# EasyEDA Pro project compute-module-v101.eprj, board digital-input-module
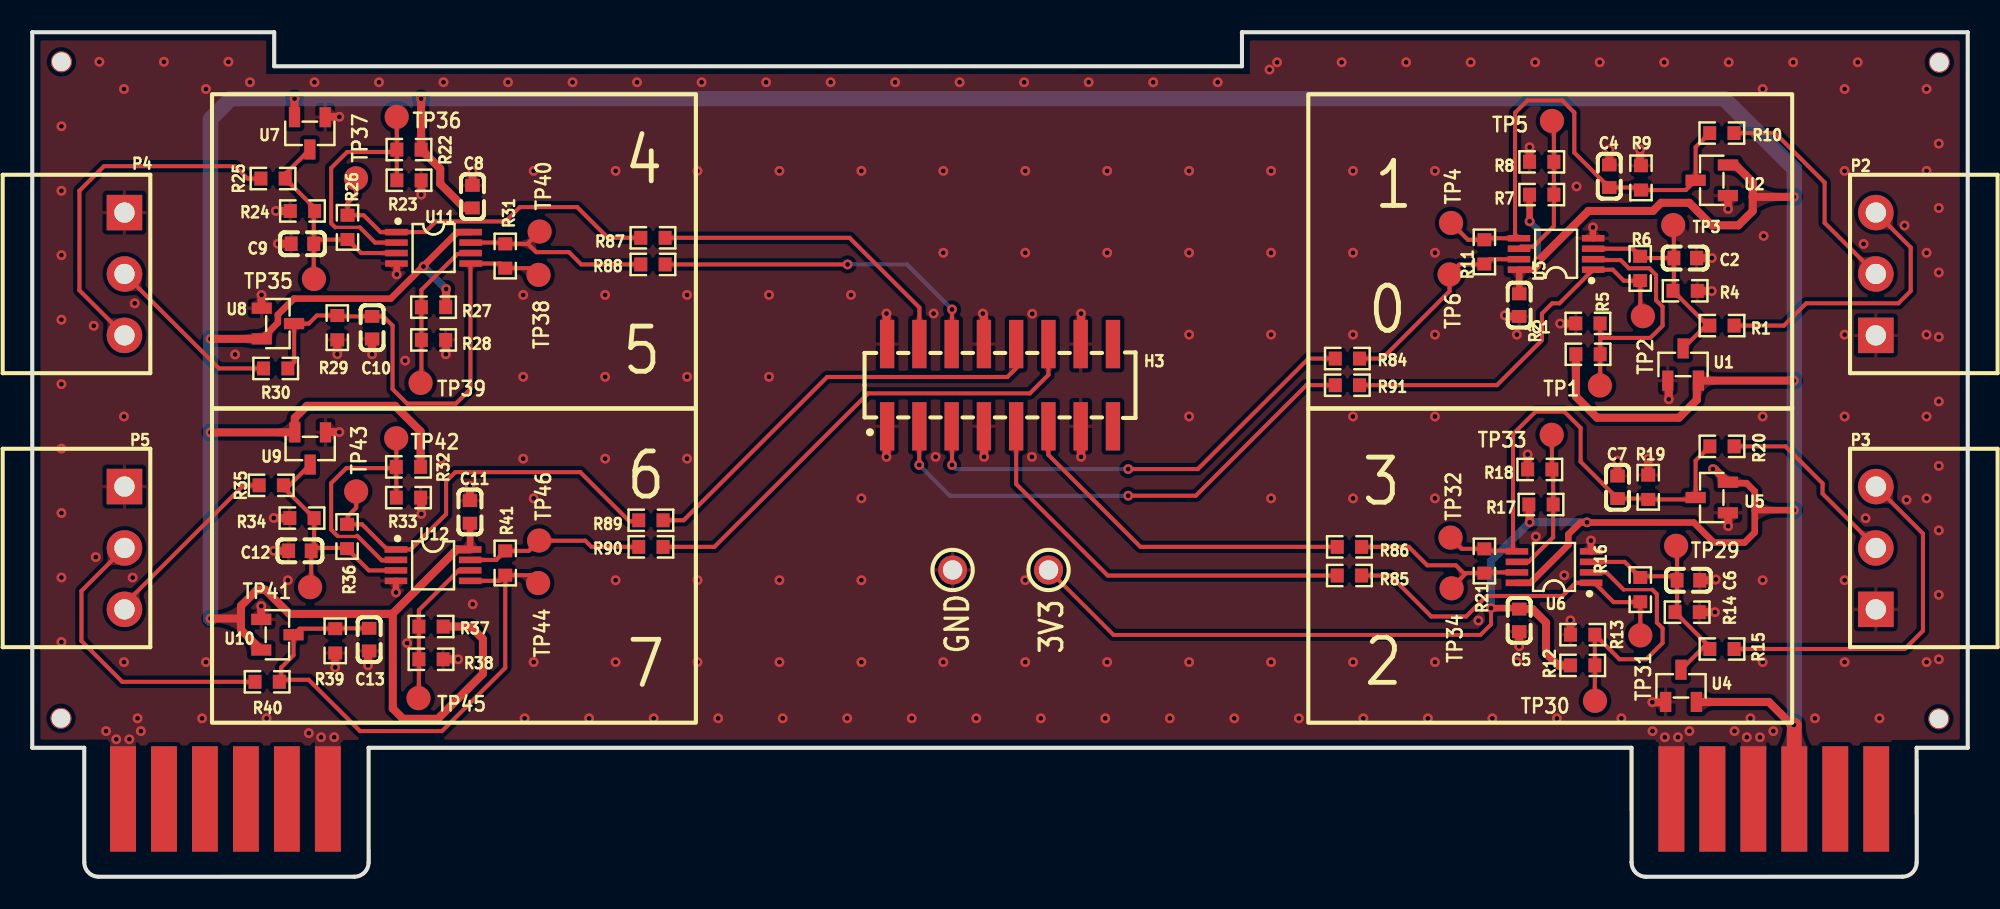
[diagram p12: board, top side]
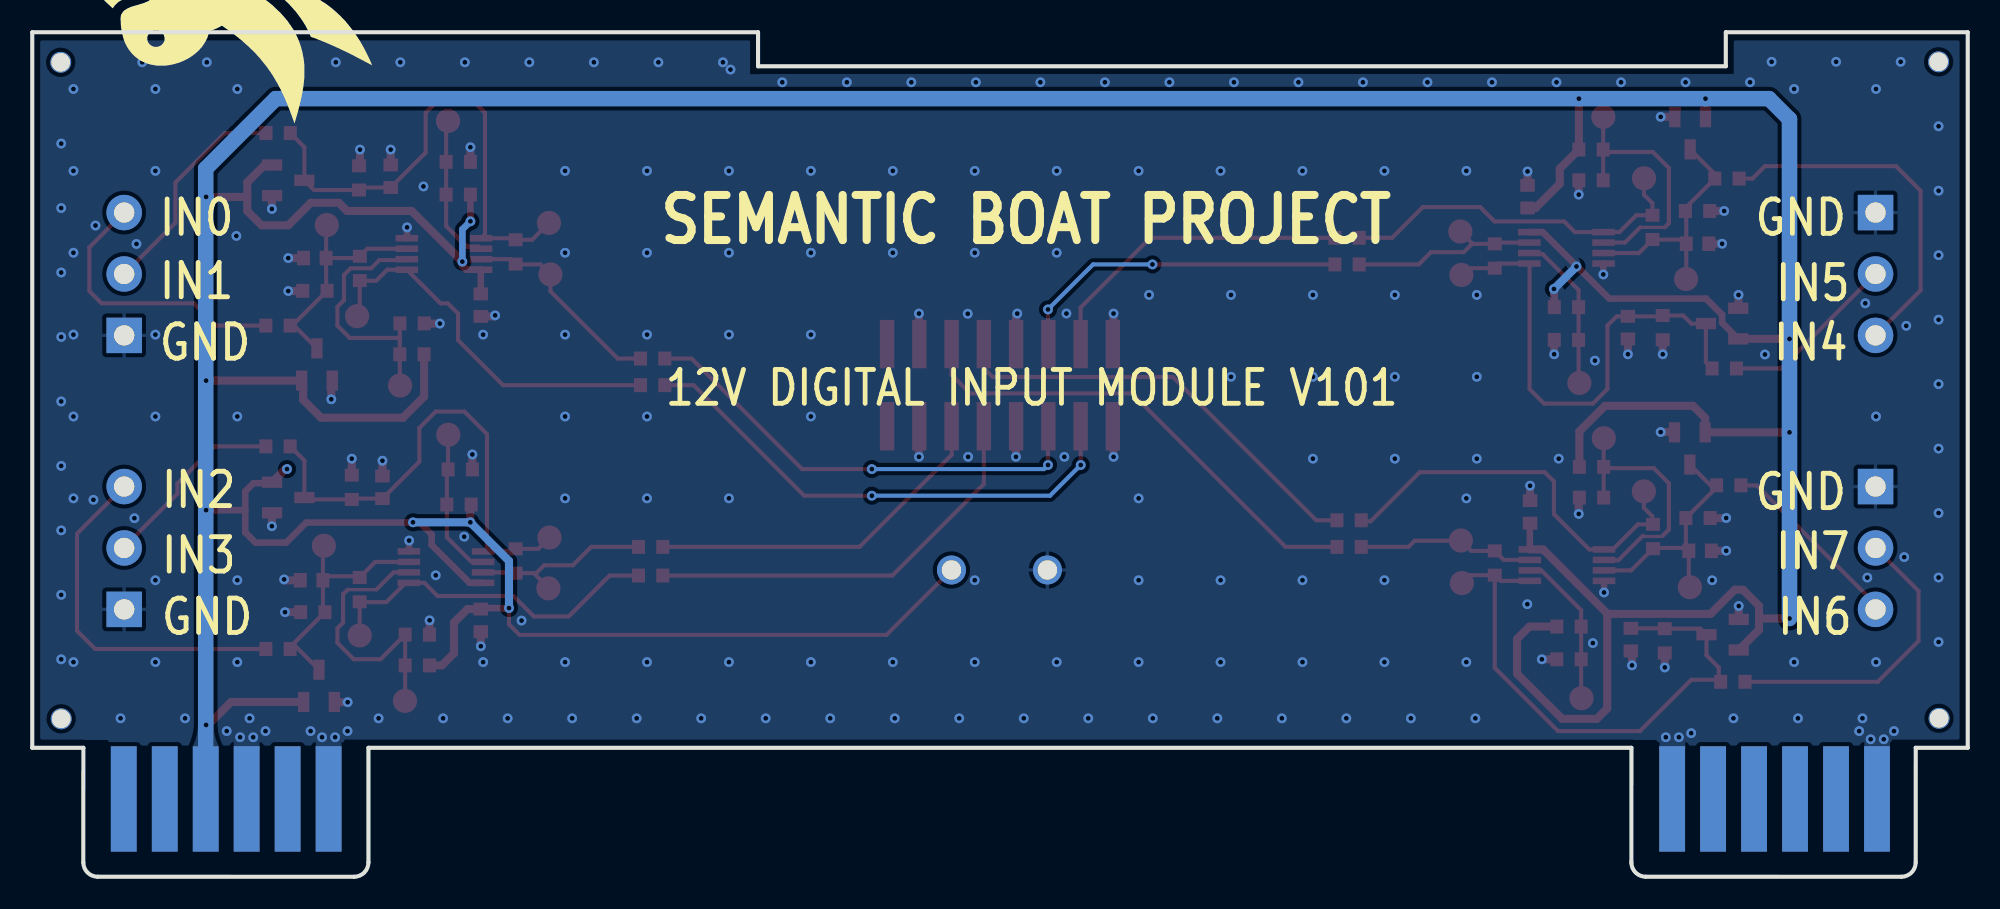
[diagram p13: board, bottom side, seen from below]

Outline 120 x 52.4 mm; copper layers: Top Layer, Inner1, Inner2, Bottom Layer. Coordinates in mm from the lower left corner of the outline.
Outline path: 0,52.4 15,52.4 15,50.29 75,50.29 75,52.4 120,52.4 120,8 116.83,8 116.83,0.89 arc(116.57,0.26) 115.94,0 100.05,0 arc(99.42,0.26) 99.16,0.89 99.15,8 20.85,8 20.86,0.89 arc(20.59,0.26) 19.96,0 4.12,0 arc(3.49,0.26) 3.23,0.89 3.22,8 0,8 0,52.4
Stack: Top Layer 0.035mm Outer layer thickness 1oz / Dielectric1 0.2104mm 7628 RC49% 8.6mil / Inner1 0.0152mm Inner layer thickness / Dielectric2 1.065mm 1.1mm H/HOZ Copper / Inner2 0.0152mm Inner layer thickness / Dielectric3 0.2104mm 7628 RC49% 8.6mil / Bottom Layer 0.035mm Outer layer thickness 1oz

## Design rules (mm)
template: Custom Config
spacing copperThickness1oz (default): track to track 0.102, other pairs 0.152 to 0.3
spacing copperThickness2oz: track to track 0.203, other pairs 0.152 to 0.3
track width copperThickness1oz (default): min 0.127, default 0.254, max 2.54
track width copperThickness2oz: min 0.203, default 0.254, max 2.54
track width power: min 0.127, default 0.5, max 2.54
differential pair differentialPair (default): width min 0.127, default 0.254, max 2.54; gap min 0.152, default 0.152
via viaSize (default): diameter min 0.5, default 0.61, max 10; hole min 0.3, default 0.305, max 6.3
net GND uses power
net +3V3 uses power

## Placement (name value [footprint] x y rotation side)
C1  100nF  [C0603]  92.19 35.47 270 top
C2  2.2nF  [C0603]  102.48 38.39 180 top
C4  2.2nF  [C0603]  97.78 43.47 270 top
C5  100nF  [C0603]  92.19 15.91 270 top
C6  2.2nF  [C0603]  102.68 18.39 180 top
C7  2.2nF  [C0603]  98.29 24.17 270 top
C8  100nF  [C0603]  27.29 42.2 90 top
C9  2.2nF  [C0603]  16.75 39.28 0 top
C10  2.2nF  [C0603]  21.07 34.07 90 top
C11  100nF  [C0603]  27.14 22.64 90 top
C12  2.2nF  [C0603]  16.6 20.22 0 top
C13  2.2nF  [C0603]  20.89 14.71 90 top
H3  XDZ200-2-08-S-2.0-G1  [HDR-SMD_16P-P2.00-V-M-R2-C8-LS6.5]  60 30.5 0 top
NOREF  -  [Pad_e5]  118.21 9.8 90 top
NOREF#2  -  [Pad_e2]  1.78 9.83 0 top
NOREF#3  -  [Pad_e3]  1.81 50.57 270 top
NOREF#4  -  [Pad_e4]  118.24 50.54 180 top
P2  WJ15EDGRC-3.81-3P  [CONN-TH_3P-P3.81_WJ15EDGRC-3.81-3P]  114.3 37.4 90 top
P3  WJ15EDGRC-3.81-3P  [CONN-TH_3P-P3.81_WJ15EDGRC-3.81-3P]  114.3 20.4 90 top
P4  WJ15EDGRC-3.81-3P  [CONN-TH_3P-P3.81_WJ15EDGRC-3.81-3P]  5.72 37.4 270 top
P5  WJ15EDGRC-3.81-3P  [CONN-TH_3P-P3.81_WJ15EDGRC-3.81-3P]  5.72 20.4 270 top
R1  3.3MΩ  [R0603]  104.76 34.2 0 top
R2  1.8MΩ  [R0603]  96.46 32.42 180 top
R4  430kΩ  [R0603]  102.48 36.36 180 top
R5  680kΩ  [R0603]  96.45 34.33 0 top
R6  10MΩ  [R0603]  99.69 37.75 90 top
R7  1.8MΩ  [R0603]  93.59 42.33 180 top
R8  680kΩ  [R0603]  93.59 44.36 0 top
R9  430kΩ  [R0603]  99.74 43.36 270 top
R10  3.3MΩ  [R0603]  104.75 46.15 0 top
R11  10MΩ  [R0603]  90.03 38.77 90 top
R12  1.8MΩ  [R0603]  96.13 13.12 180 top
R13  680kΩ  [R0603]  96.13 15.02 0 top
R14  430kΩ  [R0603]  102.6 16.42 180 top
R15  3.3MΩ  [R0603]  104.76 14.13 0 top
R16  10MΩ  [R0603]  99.7 17.82 90 top
R17  1.8MΩ  [R0603]  93.54 23.1 180 top
R18  680kΩ  [R0603]  93.47 25.27 0 top
R19  430kΩ  [R0603]  100.19 24.17 270 top
R20  3.3MΩ  [R0603]  104.76 26.71 0 top
R21  10MΩ  [R0603]  90.03 19.59 90 top
R22  1.8MΩ  [R0603]  23.36 45.12 0 top
R23  680kΩ  [R0603]  23.36 43.22 180 top
R24  430kΩ  [R0603]  16.75 41.31 0 top
R25  3.3MΩ  [R0603]  14.93 43.32 180 top
R26  10MΩ  [R0603]  19.55 40.29 270 top
R27  1.8MΩ  [R0603]  24.88 35.34 0 top
R28  680kΩ  [R0603]  24.88 33.31 180 top
R29  430kΩ  [R0603]  18.91 34.07 90 top
R30  3.3MΩ  [R0603]  15.09 31.54 180 top
R31  10MΩ  [R0603]  29.33 38.52 270 top
R32  1.8MΩ  [R0603]  23.33 25.43 0 top
R33  680kΩ  [R0603]  23.33 23.53 180 top
R34  430kΩ  [R0603]  16.72 22.26 0 top
R35  3.3MΩ  [R0603]  14.82 24.29 180 top
R36  10MΩ  [R0603]  19.52 21.11 270 top
R37  1.8MΩ  [R0603]  24.72 15.53 0 top
R38  680kΩ  [R0603]  24.72 13.49 180 top
R39  430kΩ  [R0603]  18.78 14.64 90 top
R40  3.3MΩ  [R0603]  14.56 12.1 180 top
R41  10MΩ  [R0603]  29.33 19.47 270 top
R84  1kΩ  [R0603]  81.54 32.15 180 top
R85  1kΩ  [R0603]  81.66 18.69 180 top
R86  1kΩ  [R0603]  81.66 20.47 180 top
R87  1kΩ  [R0603]  38.48 39.65 0 top
R88  1kΩ  [R0603]  38.48 37.99 0 top
R89  1kΩ  [R0603]  38.36 22.12 0 top
R90  1kΩ  [R0603]  38.36 20.47 0 top
R91  1kΩ  [R0603]  81.54 30.5 180 top
TP1  -  [Test-Point-0.5mm]  97.2 30.48 180 top
TP2  -  [Test-Point-0.5mm]  99.86 34.78 180 top
TP3  -  [Test-Point-0.5mm]  101.74 40.44 270 top
TP4  -  [Test-Point-0.5mm]  87.96 40.57 90 top
TP5  -  [Test-Point-0.5mm]  94.22 46.9 180 top
TP6  -  [Test-Point-0.5mm]  87.87 37.37 180 top
TP25  RH-5004  [TESTPOINT_TH_BD2.5-D1.2]  63.01 19.04 270 top
TP28  RH-5004  [TESTPOINT_TH_BD2.5-D1.2]  57.06 19.04 270 top
TP29  -  [Test-Point-0.5mm]  101.92 20.54 270 top
TP30  -  [Test-Point-0.5mm]  96.89 10.91 270 top
TP31  -  [Test-Point-0.5mm]  99.7 14.97 270 top
TP32  -  [Test-Point-0.5mm]  87.93 21.05 0 top
TP33  -  [Test-Point-0.5mm]  94.21 27.42 0 top
TP34  -  [Test-Point-0.5mm]  88 17.9 270 top
TP35  -  [Test-Point-0.5mm]  17.46 37.09 180 top
TP36  -  [Test-Point-0.5mm]  22.59 47.15 0 top
TP37  -  [Test-Point-0.5mm]  20.07 43.34 90 top
TP38  -  [Test-Point-0.5mm]  31.39 37.34 270 top
TP39  -  [Test-Point-0.5mm]  24.08 30.64 270 top
TP40  -  [Test-Point-0.5mm]  31.46 40.04 270 top
TP41  -  [Test-Point-0.5mm]  17.23 17.97 180 top
TP42  -  [Test-Point-0.5mm]  22.56 27.21 90 top
TP43  -  [Test-Point-0.5mm]  20.08 23.91 90 top
TP44  -  [Test-Point-0.5mm]  31.36 18.22 270 top
TP45  -  [Test-Point-0.5mm]  23.95 11.08 0 top
TP46  -  [Test-Point-0.5mm]  31.43 20.86 90 top
U1  BAV199  [SOT-23-3_L2.9-W1.3-P0.95-LS2.4-BR]  102.35 31.79 270 top
U2  BAV199  [SOT-23-3_L2.9-W1.3-P0.95-LS2.4-BR]  104.13 43.22 0 top
U3  RS8905XM  [MSOP-8_L3.0-W3.0-P0.65-LS4.9-BL]  94.48 38.64 90 top
U4  BAV199  [SOT-23-3_L2.9-W1.3-P0.95-LS2.4-BR]  102.22 11.85 270 top
U5  BAV199  [SOT-23-3_L2.9-W1.3-P0.95-LS2.4-BR]  104.13 23.53 0 top
U6  RS8905XM  [MSOP-8_L3.0-W3.0-P0.65-LS4.9-BL]  94.35 19.21 90 top
U7  BAV199  [SOT-23-3_L2.9-W1.3-P0.95-LS2.4-BR]  17.21 46.13 90 top
U8  BAV199  [SOT-23-3_L2.9-W1.3-P0.95-LS2.4-BR]  15.23 34.33 180 top
U9  BAV199  [SOT-23-3_L2.9-W1.3-P0.95-LS2.4-BR]  17.23 26.57 90 top
U10  BAV199  [SOT-23-3_L2.9-W1.3-P0.95-LS2.4-BR]  15.2 15.02 180 top
U11  RS8905XM  [MSOP-8_L3.0-W3.0-P0.65-LS4.9-BL]  24.88 39.02 270 top
U12  RS8905XM  [MSOP-8_L3.0-W3.0-P0.65-LS4.9-BL]  24.85 19.34 270 top
U23  -  [ED12BGFBK-CARD]  108 0 0 top
U24  -  [ED12BGFBK-CARD]  12 0 0 top

## Footprints (pads in the part's own frame, mm; a bottom-side part is the same pattern mirrored in y, then rotated)
C0603
  rect 0.8x0.9 smd: 1(-0.7,0) 2(0.7,0)
CONN-TH_3P-P3.81_WJ15EDGRC-3.81-3P
  rect 2.2x2.2 hole 1.26: 1(-3.81,0)
  round 2.2 hole 1.26: 2(0,0) 3(3.81,0)
ED12BGFBK-CARD
  rect 1.6x6.54 smd far side: 1(-6.375,4.826) 2(-3.835,4.826) 3(-1.295,4.826) 4(1.245,4.826) 5(3.785,4.826) 6(6.325,4.826)
  rect 1.6x6.54 smd: 7(6.325,4.826) 8(3.785,4.826) 9(1.245,4.826) 10(-1.295,4.826) 11(-3.835,4.826) 12(-6.375,4.826)
HDR-SMD_16P-P2.00-V-M-R2-C8-LS6.5
  rect 0.89x3 smd: 1(-7,-2.55) 2(-7,2.55) 3(-5,-2.55) 4(-5,2.55) 5(-3,-2.55) 6(-3,2.55) 7(-1,-2.55) 8(-1,2.55) 9(1,-2.55) 10(1,2.55) 11(3,-2.55) 12(3,2.55) 13(5,-2.55) 14(5,2.55) 15(7,-2.55) 16(7,2.55)
MSOP-8_L3.0-W3.0-P0.65-LS4.9-BL
  rect 0.406x1.397 smd: 1(-0.975,-2.3) 2(-0.325,-2.3) 3(0.325,-2.3) 4(0.975,-2.3) 5(0.975,2.3) 6(0.325,2.3) 7(-0.325,2.3) 8(-0.975,2.3)
Pad_e2
  round 1.3 hole 1.152: 1(0,0)
Pad_e3
  round 1.3 hole 1.152: 1(0,0)
Pad_e4
  round 1.3 hole 1.152: 1(0,0)
Pad_e5
  round 1.3 hole 1.152: 1(0,0)
R0603
  rect 0.806x0.864 smd: 1(-0.753,0) 2(0.753,0)
SOT-23-3_L2.9-W1.3-P0.95-LS2.4-BR
  rect 1.25x0.7 smd: 1(1,-0.95) 2(1,0.95) 3(-1,0)
Test-Point-0.5mm
  round 1.5 smd: 1(0,0)
TESTPOINT_TH_BD2.5-D1.2
  round 1.8 hole 1.2: 1(0,0)

## Nets
As in the schematic.

Pads without a net: H3 15 16; NOREF 1; NOREF#2 1; NOREF#3 1; NOREF#4 1; U23 2 5 6 7 8 11; U24 2 3 4 5 8 9 10 11

## Via types
v1: diameter 0.61, hole 0.305, Top Layer to Bottom Layer, 263 vias

## Routing (per net, layer and track width the routed paths; a pad name or vN(x,y) marks a point on that pad's centre or on a via; arc(x,y) is an arc through that point)
+3V3: length 394.8
  Top Layer w0.246: TP25.1 67.04,15.01 89.79,15.01 90.44,15.66 v1(90.44,16.67)
  Top Layer w0.406: v1(90.44,16.67) 92.13,16.67 C5.1 ; 27.37,41.42 C8.1 ; v1(93.33,38.17) 93.33,37.92 93.08,37.67 U3.8 92.19,37.65 C1.1 ; v1(92.83,40.67) R7.2 ; 106.8,22.75 106.8,21.37 106.16,20.74 104.26,20.74 103.01,21.98 95.97,21.98 95.24,21.24 95.24,20.59 92.89,18.24 U6.8 ; 106.8,22.75 v1(109.22,22.75) ; 106.8,22.75 106.8,23.91 106.29,24.42 105.19,24.42 U5.2 ; U11.8 26.35,40 22.23,35.88 16.23,35.88 15.23,34.88 15.23,34.38 U8.2 ; 27.16,20.3 U12.8 27.15,21.92 C11.1
  Top Layer w0.5: R2.2 95.7,29.79 97.02,28.48 102.1,28.48 103.2,29.59 103.2,30.69 U1.2 v1(109.22,30.79) ; 12.94,16.01 12.93,16.02 v1(11.05,16.02) ; 12.94,16.01 12.94,15.32 U10.2 ; 12.94,16.01 12.94,16.81 13.94,17.81 14.44,17.81 15.94,16.31 22.33,16.31 ; U8.2 v1(11.05,33.38) ; 22.33,16.31 26.33,20.31 U12.8 ; 22.33,16.31 22.35,16.28 22.35,10.44 22.99,9.8 25.15,9.8 27.94,12.59 27.94,14.75 27.17,15.53 R37.2 ; R17.2 92.84,23.05 v1(92.84,21.99) ; v1(24.11,48.28) R22.2 25.29,43.94 25.29,43 26.79,41.5 C8.1 ; 106.67,42.19 106.68,42.19 v1(109.22,42.19) ; 106.67,42.19 106.67,41.31 105.78,40.42 104.13,40.42 102.73,41.82 100.99,41.82 100.48,41.31 96.48,41.31 v1(93.33,38.17) ; 106.67,42.19 106.67,43.09 105.59,44.17 U2.2 ; v1(11.05,27.57) U9.2 16.28,28.47 17.03,29.22 22.49,29.22 24.08,27.63 R32.2 ; U7.2 v1(16.26,48.28) ; C5.1 93.01,16.61 93.86,15.77 93.86,13.86 94.6,13.12 R12.2 ; v1(25.66,36.47) 25.66,35.36 R27.2 ; U5.2 104.31,25.3 v1(104.2,25.3) ; U4.2 107.67,10.85 109.09,9.42 v1(109.22,9.42)
  Top Layer w0.906: U23.4 109.25,9.39 v1(109.22,9.42)
  Bottom Layer w0.406: v1(92.83,40.67) 93.33,40.17 v1(93.33,38.17)
  Bottom Layer w0.5: 109.25,30.77 109.24,30.77 v1(109.22,30.79) ; 109.22,22.73 109.25,22.7 ; v1(96.39,21.99) v1(92.84,21.99) 90.44,19.6 v1(90.44,16.67) ; v1(25.66,36.47) v1(24.26,37.87)
  Bottom Layer w0.957: 109.25,42.16 109.25,43.94 104.9,48.28 v1(24.11,48.28) v1(16.26,48.28) 12.32,48.28 11.05,47.01 v1(11.05,33.38) v1(11.05,27.57) v1(11.05,16.02) ; 109.25,42.16 U23.4 ; 109.25,42.16 v1(109.22,42.19)
GND: length 47.5
  Top Layer w0.4: v1(96.76,40.29) 96.76,39.63 U3.4 ; U11.4 22.59,38.04 v1(22.59,37.37) ; v1(22.55,17.64) U12.4 ; U6.4 96.64,20.2 v1(96.64,20.86)
  Top Layer w0.5: C13.1 20.82,13.94 v1(20.82,13.12) ; C4.1 97.78,44.17 v1(97.78,45.12) ; v1(14.97,20.23) 14.98,20.22 C12.1 ; R13.1 95.37,15.03 v1(95.37,15.91) ; U8.1 14.21,35.29 v1(14.21,36.1) ; v1(14.2,16.8) U10.1 ; v1(65.03,34.95) 65.03,33.08 H3.14 ; v1(98.29,25.82) C7.1 ; v1(21.07,32.42) C10.1 ; v1(58.93,34.95) 59,34.87 H3.8 ; v1(18.78,12.99) 18.78,13.89 ; v1(24.12,22.51) 24.12,23.49 R33.1 ; v1(19.04,47.15) 18.18,47.15 U7.1 ; R38.1 v1(26.41,13.49) ; v1(94.73,34.33) 95.69,34.33 R5.1 ; H3.13 65.03,27.93 v1(65.03,26.06) ; U2.1 105.14,42.25 v1(105.14,41.44) ; R4.1 103.24,36.34 v1(104.13,36.34) ; R23.1 24.12,43.21 v1(24.12,42.33) ; v1(100.45,10.83) 101.26,10.83 U4.1 ; U1.1 101.46,30.72 v1(101.46,29.63) ; U9.1 18.2,27.59 v1(19.04,27.59) ; v1(104.38,18.45) 104.33,18.39 C6.1 ; U5.1 105.14,22.56 v1(105.14,21.75) ; v1(52.96,34.95) 52.96,33.09 H3.2 ; v1(27.14,24.26) C11.2 ; v1(52.96,26.06) 52.96,27.91 H3.1 ; v1(15.1,41.31) R24.1 ; v1(18.91,32.42) R29.1 ; v1(59.01,26.06) 59.01,27.94 H3.7 ; v1(14.97,22.26) 14.98,22.26 R34.1 ; v1(25.64,32.42) 25.64,33.3 R28.1 ; v1(104.33,16.42) R14.1 ; v1(27.29,43.77) C8.2 ; R9.1 99.68,44.17 v1(99.68,45.12) ; v1(92.71,26.21) R18.1 ; v1(15.23,39.28) C9.1 ; v1(91.3,34.83) 91.37,34.77 C1.2 ; v1(100.19,25.94) R19.1 ; v1(92.83,45.27) R8.1 ; C2.1 v1(104.13,38.39) ; v1(92.19,14.3) C5.2
  vias: v1(1.81,46.57) v1(1.81,42.57) v1(1.81,38.57) v1(1.81,34.57) v1(1.81,30.57) v1(1.81,26.57) v1(1.81,22.57) v1(1.81,18.57) v1(1.81,14.57) v1(3.81,34.18) v1(3.94,19.83) v1(4.16,50.57) v1(4.57,9.04) v1(5.21,8.53) v1(5.69,48.88) v1(5.69,28.56) v1(5.69,13.32) v1(6.02,8.53) v1(6.22,18.56) v1(6.35,35.58) v1(6.53,9.83) v1(6.73,9.04) v1(8.16,50.57) v1(10.53,9.83) v1(10.77,48.88) v1(10.77,13.32) v1(12.16,50.57) v1(12.57,32.41) v1(13.5,49.3) v1(14.53,9.83) v1(15.85,18.4) v1(17.15,8.91) v1(17.5,49.3) v1(17.91,8.66) v1(18.72,8.66) v1(21.5,49.3) v1(23.12,32.03) v1(23.24,14.5) v1(25.36,25.94) v1(25.5,49.3) v1(27.31,16.91) v1(29.5,49.3) v1(30.44,36.1) v1(30.44,31.02) v1(30.44,25.94) v1(30.53,9.83) v1(31.09,43.8) v1(31.09,23.48) v1(31.09,13.32) v1(33.5,49.3) v1(34.53,9.83) v1(35.52,36.1) v1(35.52,31.02) v1(35.52,25.94) v1(36.17,43.8) v1(36.17,18.4) v1(36.17,13.32) v1(37.5,49.3) v1(38.53,9.83) v1(40.6,36.1) v1(40.6,31.02) v1(40.6,25.94) v1(41.25,43.8) v1(41.25,18.4) v1(41.25,13.32) v1(41.5,49.3) v1(42.53,9.83) v1(45.5,49.3) v1(45.68,36.1) v1(45.68,31.02) v1(46.33,43.8) v1(46.33,18.4) v1(46.33,13.32) v1(46.53,9.83) v1(49.5,49.3) v1(50.53,9.83) v1(50.76,36.1) v1(51.41,43.8) v1(51.41,23.48) v1(51.41,18.4) v1(51.41,13.32) v1(53.5,49.3) v1(54.53,9.83) v1(55.88,34.95) v1(56.01,26.06) v1(56.49,43.8) v1(56.49,38.72) v1(56.49,13.32) v1(57.5,49.3) v1(58.53,9.83) v1(61.5,49.3) v1(61.57,43.8) v1(61.57,38.72) v1(61.57,18.4) v1(61.57,13.32) v1(62,34.93) v1(61.98,26.06) v1(62.53,9.83) v1(65.5,49.3) v1(66.53,9.83) v1(66.65,43.8) v1(66.65,38.72) v1(66.65,13.32) v1(69.5,49.3) v1(70.53,9.83) v1(71.73,43.8) v1(71.73,38.72) v1(71.73,33.64) v1(71.73,28.56) v1(71.73,13.32) v1(73.5,49.3) v1(74.53,9.83) v1(76.71,50.09) v1(76.81,43.8) v1(76.81,38.72) v1(76.81,33.64) v1(76.81,23.48) v1(76.81,13.32) v1(77.18,50.54) v1(78.53,9.83) v1(81.18,50.54) v1(81.89,43.8) v1(81.89,38.72) v1(81.89,33.64) v1(81.89,28.56) v1(81.89,23.48) v1(81.89,13.32) v1(82.53,9.83) v1(85.18,50.54) v1(86.53,9.83) v1(86.97,43.8) v1(86.97,38.72) v1(86.97,33.64) v1(86.97,28.56) v1(86.97,23.48) v1(86.97,13.32) v1(89.18,50.54) v1(89.66,15.9) v1(90.53,9.83) v1(92.05,33.64) v1(92.05,13.32) v1(93.18,50.54) v1(93.22,21.1) v1(94.53,9.83) v1(94.98,18.7) v1(95.75,42.83) v1(97.18,50.54) v1(98.53,9.83) v1(100.45,9.04) v1(101.18,50.54) v1(101.22,8.66) v1(102.03,8.66) v1(102.74,9.04) v1(105.18,50.54) v1(105.54,9.04) v1(106.3,8.66) v1(106.53,9.83) v1(107.11,8.66) v1(107.29,48.88) v1(107.35,39.76) v1(107.29,28.56) v1(107.29,18.4) v1(107.29,13.32) v1(107.94,9.04) v1(109.18,50.54) v1(110.53,9.83) v1(112.37,48.88) v1(112.37,43.8) v1(112.37,33.64) v1(112.37,28.56) v1(112.37,18.4) v1(112.37,13.32) v1(113.18,50.54) v1(113.54,39.26) v1(113.67,22.25) v1(114.53,9.83) v1(116.08,40.41) v1(116.21,23.39) v1(117.45,48.88) v1(117.45,43.8) v1(117.45,38.72) v1(117.45,33.64) v1(117.45,28.56) v1(117.45,23.48) v1(117.45,13.32) v1(118.21,45.49) v1(118.21,41.49) v1(118.21,37.49) v1(118.21,33.49) v1(118.21,29.49) v1(118.21,25.49) v1(118.21,21.49) v1(118.21,17.49) v1(118.21,13.49)
DIG_IN_0: length 17.6
  Top Layer w0.254: P2.3 116.46,39.05 116.46,36.34 115.7,35.58 109.98,35.58 108.6,34.2 105.52,34.2
DIG_IN_1: length 13.9
  Top Layer w0.254: R10.2 108.06,46.15 111.13,43.07 111.13,40.58 P2.2
DIG_IN_2: length 22.3
  Top Layer w0.254: 105.52,14.13 116.09,14.13 117.22,15.26 117.22,21.29 P3.3
DIG_IN_3: length 11.8
  Top Layer w0.254: P3.2 114.3,20.47 111,23.77 111,24.41 108.7,26.71 105.52,26.71
DIG_IN_4: length 22.3
  Top Layer w0.254: 14.18,43.32 13.34,43.32 12.57,44.09 4.45,44.09 2.92,42.57 2.92,36.39 P4.3
DIG_IN_5: length 11.1
  Top Layer w0.254: 14.34,31.54 11.58,31.54 P4.2
DIG_IN_6: length 11.7
  Top Layer w0.254: R35.2 14.05,24.28 13.08,24.28 5.72,16.91 P5.3
DIG_IN_7: length 18.7
  Top Layer w0.254: R40.2 5.58,12.1 3.05,14.63 3.05,17.73 P5.2
MCU_DIG_IN_0: length 23.9
  Top Layer w0.254: TP2.1 99.7,34.94 99.7,36.99 R6.1 99.68,36.98 98.68,36.98 97.99,37.67 U3.1 94.69,35.58 94.24,35.58 93.6,34.95 93.6,33.3 90.81,30.5 R91.1
MCU_DIG_IN_1: length 13.1
  Top Layer w0.254: U3.7 90.33,38.32 R11.1 90.01,37.99 88.49,37.99 TP6.1 87.87,36.33 83.7,32.15 R84.1
MCU_DIG_IN_2: length 21.8
  Top Layer w0.254: R85.1 84.2,18.69 86.74,16.15 88.9,16.15 90.17,17.42 94.87,17.42 95.69,18.24 U6.1 96.85,18.24 98.05,17.04 99.67,17.04 R16.1 99.7,17.06 TP31.1
MCU_DIG_IN_3: length 11.6
  Top Layer w0.254: TP34.1 88,17.94 88.9,18.84 ; 88.9,18.84 88.75,18.84 88.27,19.33 86.49,19.33 85.35,20.47 R86.1 ; 88.9,18.84 R21.1 90.08,18.89 U6.7
MCU_DIG_IN_4: length 22.6
  Top Layer w0.254: R87.1 35.69,39.65 33.78,41.55 30.23,41.55 29.34,40.66 25.02,40.66 24.36,40 U11.1 21.59,40 20.54,41.05 R26.1 19.55,41.79 20.07,42.31 TP37.1
MCU_DIG_IN_5: length 12.2
  Top Layer w0.254: 30.69,39.27 30.73,39.27 31.24,38.76 33.28,38.76 34.04,37.99 R88.1 ; 30.69,39.27 TP40.1 ; 30.69,39.27 R31.1 29.25,39.35 U11.7
MCU_DIG_IN_6: length 25.5
  Top Layer w0.254: R89.1 37.54,22.06 37.02,22.06 33.97,25.1 26.23,25.1 25.66,24.53 25.66,22.5 23.47,20.31 U12.1 22.01,20.31 20.45,21.87 R36.1 19.56,21.91 19.56,22.37 20.08,22.9 TP43.1
MCU_DIG_IN_7: length 11.1
  Top Layer w0.254: U12.7 28.77,19.66 R41.1 30.78,20.22 TP46.1 31.44,20.85 34.29,20.85 34.67,20.47 R90.1
$1N594: length 15.7
  Top Layer w0.254: U3.2 96.83,38.26 98.48,38.26 98.99,37.75 100.26,37.75 100.67,37.34 100.67,35.77 101.08,35.36 101.08,34.2 100.32,33.44 97.34,33.44 97.21,33.31 ; TP1.1 97.21,30.5 R2.1 97.21,33.31 ; R5.2 97.21,34.33 97.21,33.31
$1N605: length 14.7
  Top Layer w0.254: 96.78,38.97 99.22,38.97 R6.2 99.8,38.39 C2.2 ; R1.1 103.88,34.33 103.76,34.33 ; C2.2 101.78,36.41 R4.2 103.76,34.33 ; C2.2 101.78,40.4 TP3.1 ; U1.3 103.76,34.19 103.76,34.33
$1N1512: length 9.3
  Top Layer w0.254: TP5.1 94.34,46.78 94.34,40.37 93.07,39.1 92.31,39.1 92.18,38.97
$1N1525: length 31.4
  Top Layer w0.254: R10.1 103.13,45.27 U2.3 102.52,42.61 R9.2 99.58,42.77 C4.2 95.61,44.93 95.61,47.42 94.86,48.17 92.7,48.17 91.93,47.4 91.93,39.86 U3.5 90.13,39.62 R11.2 89.01,39.52 TP4.1
$1N5232: length 9.3
  Top Layer w0.254: TP33.1 94.22,27.41 R18.2 94.3,25.2 R17.1 94.3,21.07 92.77,19.54 U6.6
$1N5233: length 30.4
  Top Layer w0.254: R20.1 103.13,25.82 U5.3 103.01,23.41 R19.2 100.14,23.47 C7.2 96,25.75 96,27.85 94.98,28.86 93.21,28.86 91.81,27.47 91.81,20.23 90.15,20.23 90.03,20.35 88.63,20.35 TP32.1
$1N5242: length 17.2
  Top Layer w0.2: 100.45,17.82 98.67,17.82
  Top Layer w0.254: U6.2 97.6,18.89 98.67,17.82 ; 100.45,17.82 100.73,17.53 100.73,15.77 101.08,15.42 101.08,14.51 100.06,13.5 98.4,13.5 96.88,15.02 96.88,10.92 TP30.1
$1N5244: length 15.4
  Top Layer w0.254: U6.3 98.73,19.54 R16.2 99.78,18.65 101.98,18.65 ; 101.98,18.65 101.98,20.48 TP29.1 ; 101.98,18.65 C6.2 101.98,16.55 R14.2 103.88,14.39 103.88,14.26 ; 103.88,14.26 R15.1 ; 103.88,14.26 103.64,14.26 U4.3
$1N7199: length 31.3
  Top Layer w0.254: TP38.1 30.97,37.76 29.33,37.76 29.04,38.05 U11.5 27.17,38.04 27.17,30.26 26.26,29.36 23.24,29.36 22.34,30.26 22.34,34.2 21.77,34.77 C10.2 18.96,34.77 R29.2 17.64,34.82 17.13,34.32 16.24,34.32 ; 16.24,34.32 16.24,31.93 R30.1 ; 16.24,34.32 U8.3
$1N7200: length 9.7
  Top Layer w0.254: TP45.1 23.97,11.1 R38.2 R37.1 23.97,16.54 26.44,19.01 U12.6
$1N7201: length 35.4
  Top Layer w0.254: 27.69,18.31 27.64,18.36 ; 27.64,18.36 U12.5 ; 27.64,18.36 28.97,18.36 R41.2 ; 15.44,12.22 17.14,12.22 20.32,9.04 25.4,9.04 29.33,12.96 R41.2 ; 15.44,12.22 R40.1 ; 15.44,12.22 15.44,12.99 16.2,13.75 U10.3 16.57,15.39 R39.2 18.81,15.42 20.89,15.42 ; TP44.1 30.87,18.71 R41.2
$1N7222: length 16.4
  Top Layer w0.2: 18.91,21.16 18.96,21.12 20.09,21.12 20.14,21.16
  Top Layer w0.254: 22.57,25.18 22.39,25.36 19.47,25.36 18.53,24.42 18.53,21.54 18.91,21.16 ; 22.57,25.18 R33.2 ; 22.57,25.18 R32.1 22.57,27.71 22.56,27.72 ; 20.14,21.16 21.66,19.64 22.53,19.64 U12.2
$1N7223: length 15
  Top Layer w0.254: U12.3 20.87,19.01 R36.2 19.47,20.4 17.48,20.4 ; 15.7,24.16 15.7,24.03 R34.2 17.48,20.4 ; 15.7,24.16 R35.1 ; 15.7,24.16 15.82,24.16 U9.3 ; 17.48,20.4 C12.2 17.3,18.04 TP41.1
$1N7253: length 16.4
  Top Layer w0.2: 18.78,40.29 20.31,40.29
  Top Layer w0.254: 18.78,40.29 18.53,40.55 18.53,43.98 19.52,44.97 22.49,44.97 22.6,44.86 ; 20.31,40.29 21.25,39.35 U11.2 ; 22.6,44.86 R22.1 22.6,47.14 TP36.1 ; 22.6,44.86 R23.2
$1N7260: length 14.9
  Top Layer w0.254: 17.45,39.53 C9.2 17.45,37.1 TP35.1 ; 17.45,39.53 17.45,41.26 R24.2 17.51,41.5 R25.1 15.68,43.6 U7.3 ; 17.45,39.53 19.54,39.53 R26.2 20.39,38.7 U11.3
$1N7262: length 9.8
  Top Layer w0.254: TP39.1 24.13,30.69 R28.2 R27.1 24.13,36.41 26.36,38.64 27.12,38.64 U11.6
$1N10197: length 31.8
  Top Layer w0.254: H3.3 54.99,27.94 v1(54.99,25.55) ; R91.2 79,30.5 72.14,23.64 v1(67.95,23.64)
  Bottom Layer w0.254: v1(67.95,23.64) 56.9,23.64 v1(54.99,25.55)
$1N10198: length 29.1
  Top Layer w0.254: v1(57.02,25.55) 57.02,27.93 H3.5 ; R84.2 79.12,32.15 72.27,25.29 v1(67.95,25.29)
  Bottom Layer w0.254: v1(57.02,25.55) 57.28,25.29 v1(67.95,25.29)
$1N10199: length 25.8
  Top Layer w0.254: R85.2 66.68,18.69 61,24.37 H3.9
$1N10200: length 22.1
  Top Layer w0.254: H3.11 62.99,27.94 62.99,26.18 68.71,20.47 R86.2
$1N10209: length 19.8
  Top Layer w0.254: H3.4 55,35.32 50.67,39.65 R87.2
$1N10210: length 21.1
  Top Layer w0.254: R88.2 v1(50.55,37.99) ; v1(57.02,35.2) 57.02,33.07 H3.6
  Bottom Layer w0.254: v1(50.55,37.99) 54.23,37.99 v1(57.02,35.2)
$1N10211: length 27.3
  Top Layer w0.254: R89.2 40.39,22.12 49.28,31.01 60.45,31.01 61,31.56 H3.10
$1N10212: length 30.2
  Top Layer w0.254: R90.2 42.29,20.47 51.82,29.99 61.85,29.99 63,31.14 H3.12

## Copper pours and planes (outline as drawn; the poured copper is in the pictures)
GND on Top Layer: 4.83,8.92 6.43,8.92 6.43,7.78 4.83,7.78
GND on Top Layer: 17.53,9.05 19.13,9.05 19.13,7.91 17.53,7.91
GND on Top Layer: 105.92,9.05 107.52,9.05 107.52,7.91 105.92,7.91
GND on Top Layer: 100.84,9.05 102.44,9.05 102.44,7.91 100.84,7.91
GND on Top Layer: -3.81,55.39 123.19,55.39 123.19,7.13 -3.81,7.13
GND on Bottom Layer: 4.81,8.93 6.41,8.93 6.41,7.78 4.81,7.78
GND on Bottom Layer: 17.52,9.05 19.11,9.05 19.11,7.91 17.52,7.91
GND on Bottom Layer: 105.91,9.05 107.51,9.05 107.51,7.91 105.91,7.91
GND on Bottom Layer: 100.83,9.05 102.43,9.05 102.43,7.91 100.83,7.91
GND on Bottom Layer: -4.82,56.03 124.21,56.03 124.21,6.37 -4.82,6.37
GND on Inner1: -3.05,55.14 122.56,55.14 122.56,-0.74 -3.05,-0.74
GND on Inner2: -3.94,56.16 123.45,56.16 123.45,-1.5 -3.94,-1.5

Small or netless copper shapes (teardrops, artwork), in the pictures only: 366 on Top Layer, 15 on Bottom Layer

## Text on the board
Bottom Silkscreen Layer: 12V DIGITAL INPUT MODULE V101 | IN6 | IN5 | IN7 | IN4 | GND | IN2 | IN3 | IN0 | IN1 | SEMANTIC BOAT PROJECT
Top Silkscreen Layer: GND | 3V3 | 5 | 4 | 6 | 7 | 3 | 2 | 0 | 1
